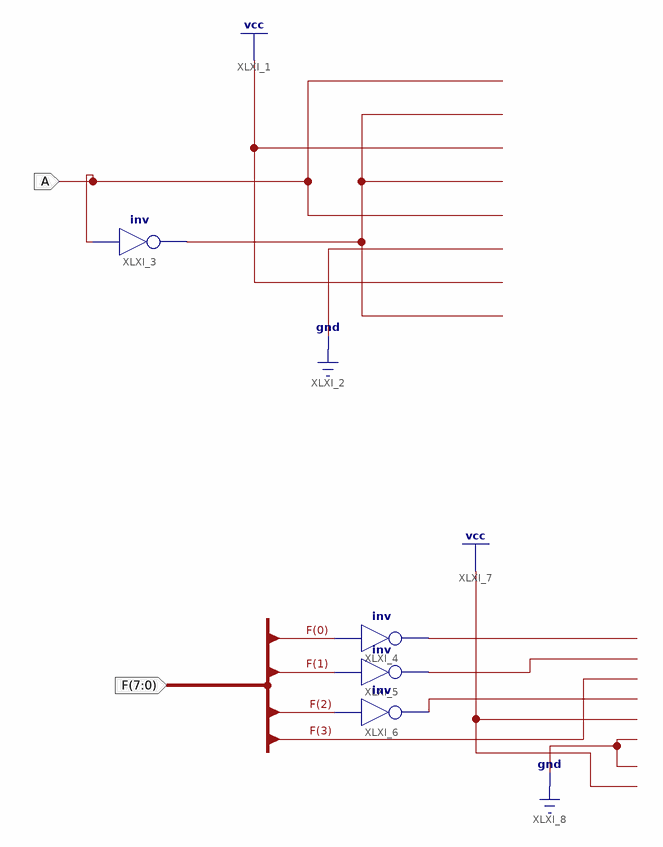
[diagram p0: schematic sheet 1]
// Xilinx ISE schematic C3_25.sch (kintex7) as structural Verilog: 4 symbols, 2 ports
module C3_25 (
  input  A,
  input  [7:0] F
);

  wire XLXN_11, XLXN_23, XLXN_24, XLXN_25;

  not XLXI_3 (XLXN_11, A);
  not XLXI_4 (XLXN_23, F[0]);
  not XLXI_5 (XLXN_25, F[1]);
  not XLXI_6 (XLXN_24, F[2]);
endmodule
